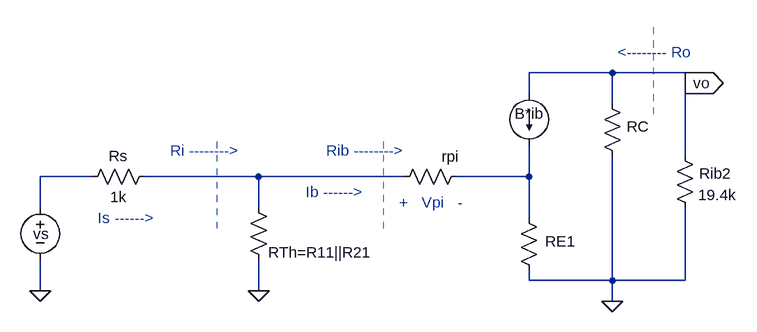
[diagram p0: schematic casc_ce__small-signal.asc]
casc_ce__small-signal.asc, the LTspice schematic file:
Version 4
SHEET 1 1152 680
WIRE 768 -64 640 -64
WIRE 880 -64 768 -64
WIRE 880 -48 880 -64
WIRE 640 -32 640 -64
WIRE 768 -16 768 -64
WIRE 880 64 880 -48
WIRE -32 96 -112 96
WIRE 224 96 48 96
WIRE 448 96 224 96
WIRE 640 96 640 48
WIRE 640 96 528 96
WIRE -112 144 -112 96
WIRE 224 144 224 96
WIRE 640 160 640 96
WIRE 640 256 640 240
WIRE 768 256 768 64
WIRE 768 256 640 256
WIRE 880 256 880 144
WIRE 880 256 768 256
WIRE -112 272 -112 224
WIRE 224 272 224 224
WIRE 768 288 768 256
FLAG -112 272 0
FLAG 768 288 0
FLAG 224 272 0
FLAG 880 -48 vo
IOPIN 880 -48 Out
SYMBOL res 208 128 R0
WINDOW 0 31 85 Left 2
SYMATTR InstName RTh=R11||R21
SYMATTR Value ""
SYMBOL res 544 80 R90
WINDOW 0 1 25 VBottom 2
WINDOW 3 32 56 VTop 2
SYMATTR InstName rpi
SYMATTR Value ""
SYMBOL res 656 256 R180
WINDOW 0 -55 60 Left 2
WINDOW 3 36 40 Left 2
SYMATTR InstName RE1
SYMATTR Value ""
SYMBOL current 640 -32 R0
WINDOW 0 -22 31 Left 2
SYMATTR InstName B*ib
SYMATTR Value ""
SYMBOL res 784 80 R180
WINDOW 0 -41 61 Left 2
WINDOW 3 36 40 Left 2
SYMATTR InstName RC
SYMATTR Value ""
SYMBOL voltage -112 128 R0
WINDOW 0 -11 56 Left 2
SYMATTR InstName vs
SYMATTR Value ""
SYMBOL res 64 80 R90
WINDOW 0 0 56 VBottom 2
WINDOW 3 32 56 VTop 2
SYMATTR InstName Rs
SYMATTR Value 1k
SYMBOL res 864 48 R0
WINDOW 0 38 43 Left 2
SYMATTR InstName Rib2
SYMATTR Value 19.4k
TEXT 328 56 Left 2 ;Rib -------->
TEXT 88 56 Left 2 ;Ri -------->
TEXT 776 -96 Left 2 ;<-------- Ro
TEXT 440 136 Left 2 ;+   Vpi   -
TEXT 296 120 Left 2 ;Ib ------>
TEXT -24 160 Left 2 ;Is ------>
LINE Normal 416 176 416 32 2
LINE Normal 160 176 160 32 2
LINE Normal 832 0 832 -144 2

The netlist it stands for:
* casc_ce__small-signal.asc
RTh=R11||R21 N002 0
rpi N003 N002
RE1 0 N003
I§B*ib vo N003
RC 0 vo
vs N001 0
Rs N002 N001 1k
Rib2 vo 0 19.4k
* Rib -------->
* Ri -------->
* <-------- Ro
* +   Vpi   -
* Ib ------>
* Is ------>
.backanno
.end